# Altium schematic sheet 智能家居-开关-按键板.SchDoc
size A4
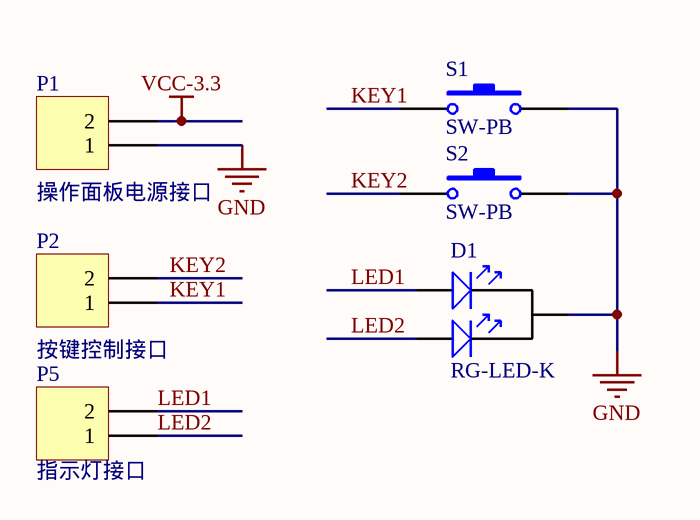
[diagram p0: 智能家居-开关-按键板.SchDoc]

## Parts
D1  RG-LED-K  [RG-LED]
P1  操作面板电源接口  [DG1282]
P2  按键控制接口  [DG1282]
P5  指示灯接口  [DG1282]
S1  SW-PB  [KEY_M]
S2  SW-PB  [KEY_M]

## Nets
GND: D1.2(GND) P1.1 S1.2 S2.2
VCC-3.3: P1.2
KEY1: P2.1 S1.1
KEY2: P2.2 S2.1
LED1: D1.1(R) P5.2
LED2: D1.3(G) P5.1

## Library data of the parts
P1 P2 P5 = Header 2H: Header, 2-Pin, Right Angle; LatestRevisionDate: 17-Jul-2002; LatestRevisionNote: Re-released for DXP Platform.; Publisher: Altium Limited
S1 S2 = SW-PB: Switch; Published: 24-Mar-1999; LatestRevisionDate: 17-Jul-2002; LatestRevisionNote: Re-released for DXP Platform.; PackageReference: SPST-2; Publisher: Altium Limited; PackageDescription: Switch; 2 Leads